# EAGLE design BCARDLIGHT (EAGLE 6.5.0)
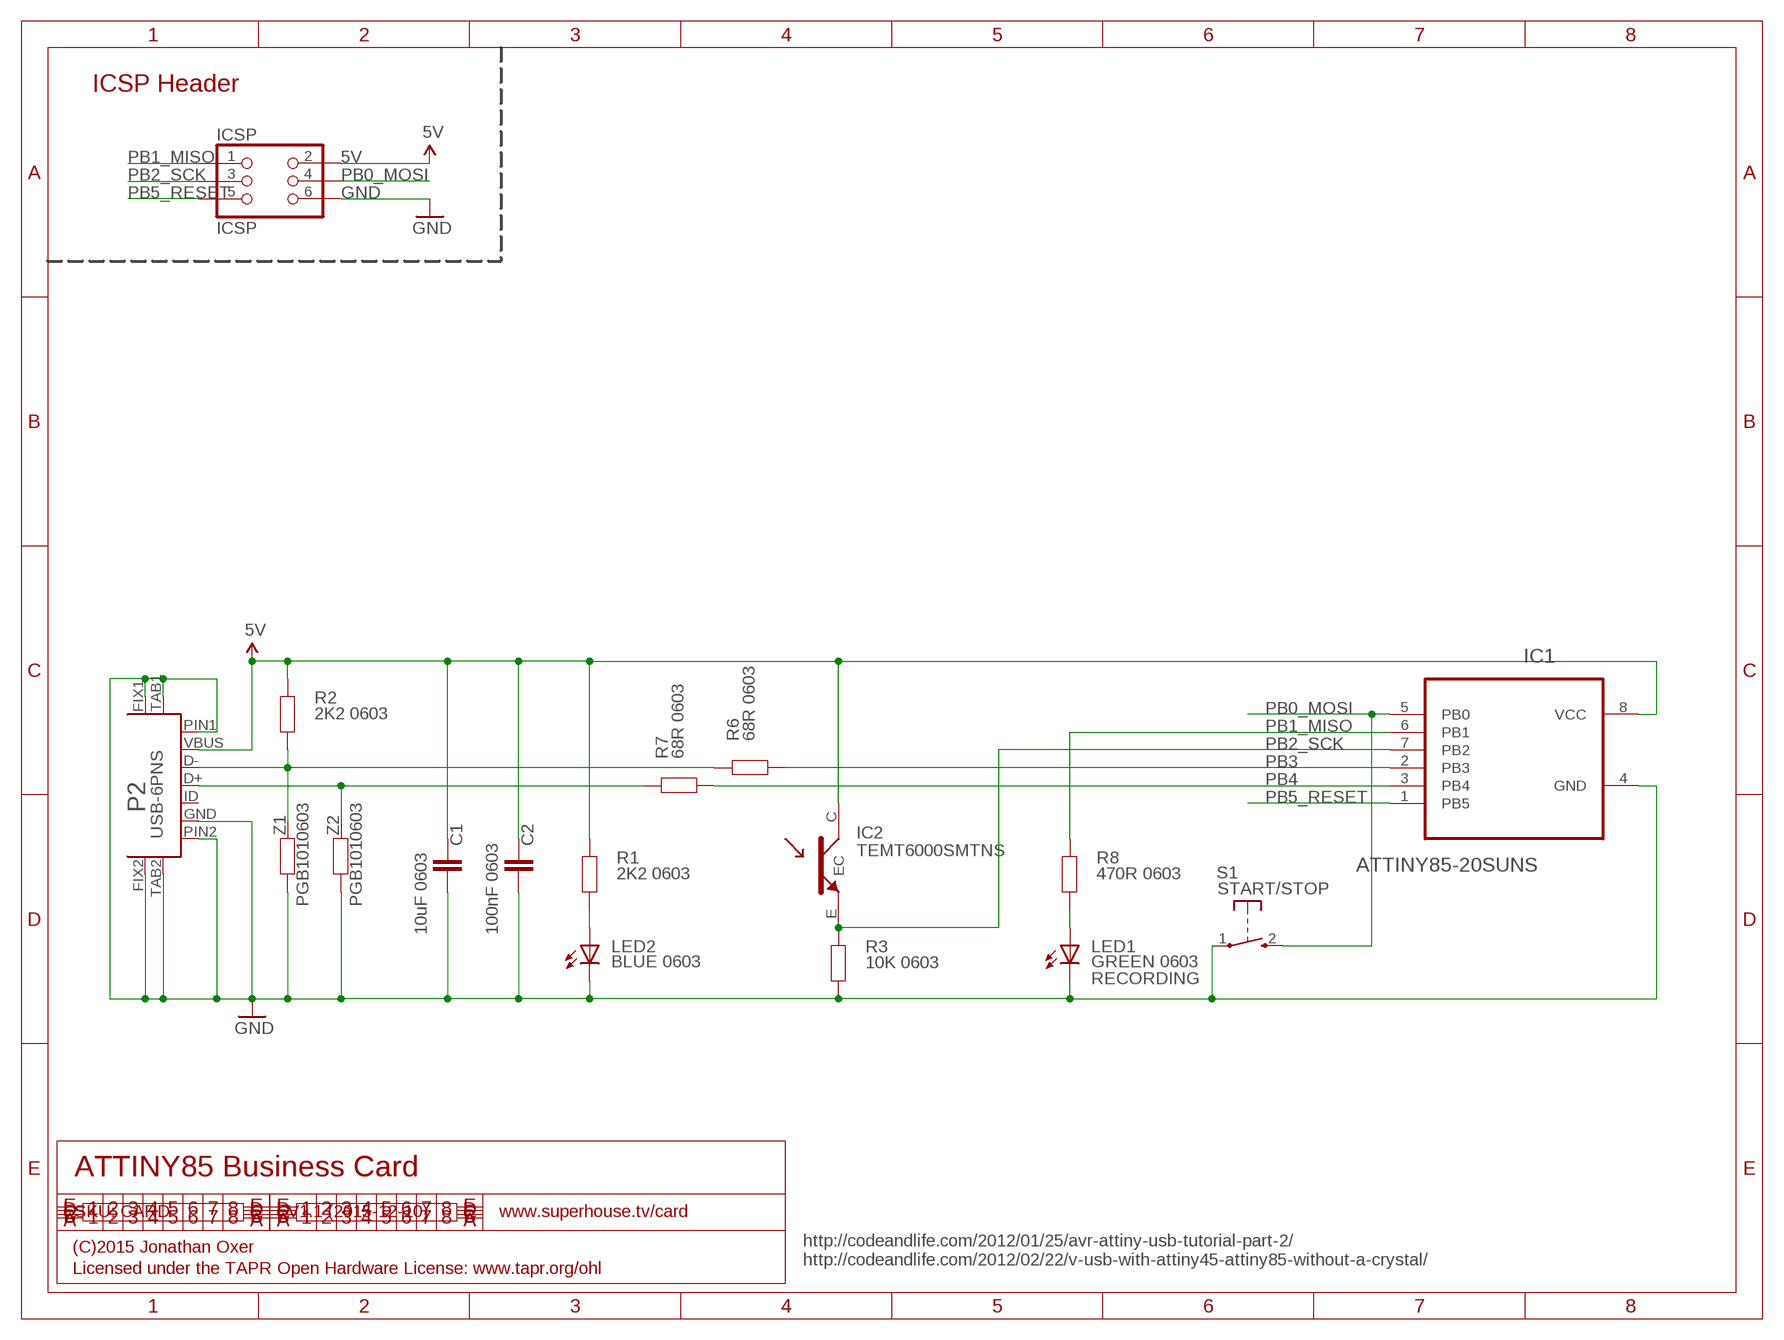
[diagram p0: schematic, sheet 1]

## Parts
C1  10uF 0603  CAPNS  [0603_NO_SILK]
C2  100nF 0603  CAPNS  [0603_NO_SILK]
IC1  ATTINY85-20SUNS  [SOIC127P798X216-8N_NO_SILK]
IC2  TEMT6000SMTNS  [TEMT6000_NO_SILK]
ICSP  ICSP  ICSPSMTNS  [2X03SURFACE_NO_SILK]
LED1  GREEN 0603  LED0603NS  [0603_NO_SILK]
LED2  BLUE 0603  LED0603NS  [0603_NO_SILK]
P2  USB-6PNS  [USB-MICROB-MB05PMXX_NO_SILK]
R1  2K2 0603  RESISTOR0603NS  [0603_NO_SILK]
R2  2K2 0603  RESISTOR0603NS  [0603_NO_SILK]
R3  10K 0603  RESISTOR0603NS  [0603_NO_SILK]
R6  68R 0603  RESISTOR0603NS  [0603_NO_SILK]
R7  68R 0603  RESISTOR0603NS  [0603_NO_SILK]
R8  470R 0603  RESISTOR0603NS  [0603_NO_SILK]
S1  START/STOP  TAC_SWITCH_2PINNS  [TACTILE_SWITCH_SMD_2PIN_TINY_NO_SILK]
Z1  PGB1010603  RESISTOR0603NS  [0603_NO_SILK]
Z2  PGB1010603  RESISTOR0603NS  [0603_NO_SILK]

## Nets
5V: C1.1 C2.1 IC1.8(VCC) IC2.C ICSP.2 P2.VBUS R1.2 R2.2
D+: P2.D+ R7.2 Z2.2
D-: P2.D- R2.1 R6.2 Z1.2
GND: C1.2 C2.2 IC1.4(GND) ICSP.6 LED1.2(C) LED2.2(C) P2.FIX1 P2.FIX2 P2.GND P2.PIN1 P2.PIN2 P2.TAB1 P2.TAB2 R3.1 S1.1(P) Z1.1 Z2.1
N$1: LED2.1(A) R1.1
N$11: LED1.1(A) R8.1
PB0_MOSI: IC1.5(PB0) ICSP.4 S1.2(S)
PB1_MISO: IC1.6(PB1) ICSP.1 R8.2
PB2_SCK: IC1.7(PB2) IC2.E ICSP.3 R3.2
PB3: IC1.2(PB3) R6.1
PB4: IC1.3(PB4) R7.1
PB5_RESET: IC1.1(PB5) ICSP.5
Unconnected: P2.ID

## Notes on the sheet
- ICSP Header
- RECORDING
- ATTINY85 Business Card
- SKU: CARD | V1.1 (2015-12-10) | www.superhouse.tv/card
- (C)2015 Jonathan Oxer
- http://codeandlife.com/2012/01/25/avr-attiny-usb-tutorial-part-2/
  http://codeandlife.com/2012/02/22/v-usb-with-attiny45-attiny85-without-a-crystal/
- Licensed under the TAPR Open Hardware License: www.tapr.org/ohl

## Library data of the parts
C1 C2 = freetronics-jon:CAP: Capacitor Standard 0603 ceramic capacitor, and 0.1" leaded capacitor.
IC1 = freetronics-jon:ATTINY85-20SU: 8-bit Microcontroller with In-System Programmable Flash
IC2 = freetronics-jon:TEMT6000
ICSP = freetronics-jon:ICSP
LED1 LED2 = freetronics-jon:LED: LEDs Standard schematic elements and footprints for 5mm, 3mm, 1206, and 0603 sized LEDs. 5mm - Spark Fun Electronics SKU : COM-00529 (and others)
P2 = freetronics-jon:USB-6P
R1-R3 R6-R8 Z1 Z2 = freetronics-jon:RESISTOR: Resistor Basic schematic elements and footprints for 0603, 1206, and PTH 1/10th watt (small) resistors.
S1 = freetronics-jon:TAC_SWITCH_2PIN: Momentary Tactile Switch - 2 pin

## Net classes
0 default: width 0.152 mm, drill 0.241 mm, clearance 0.152 mm

## Board
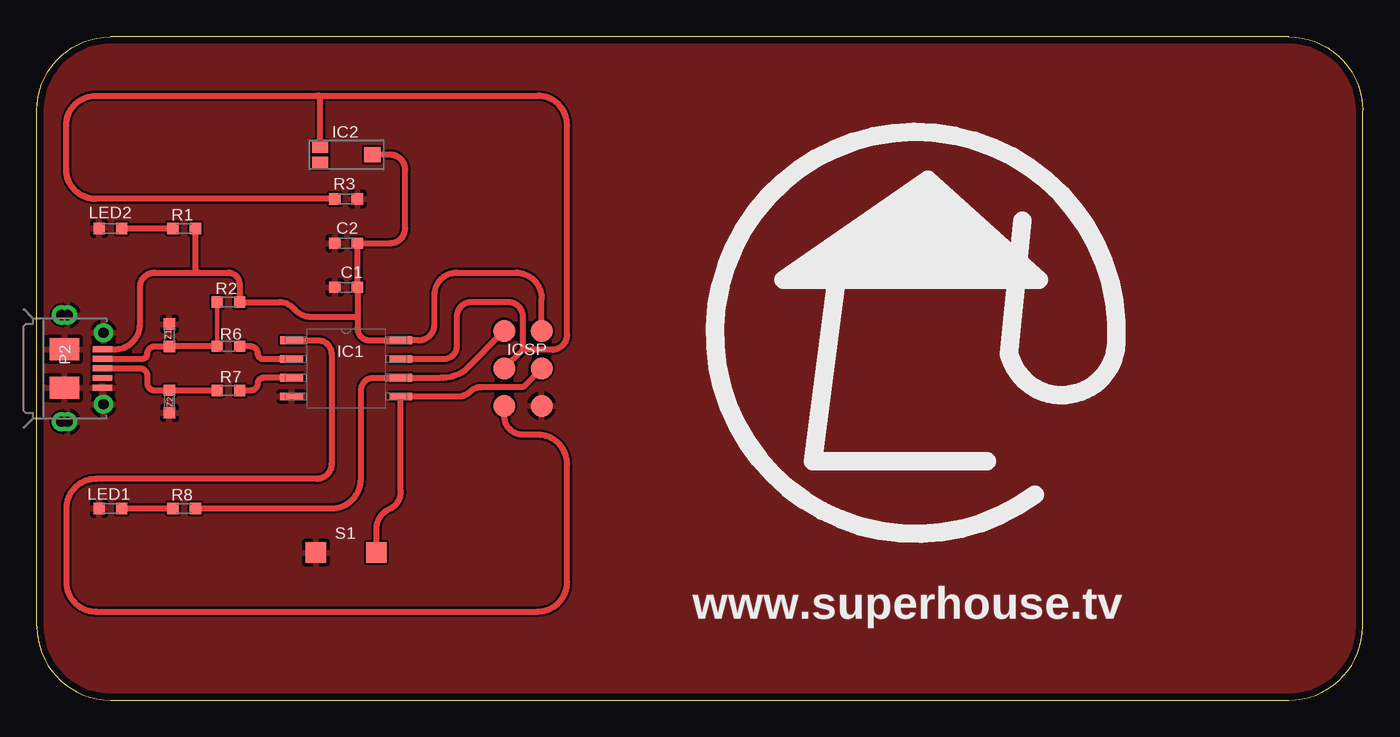
[diagram p1: board, top side]
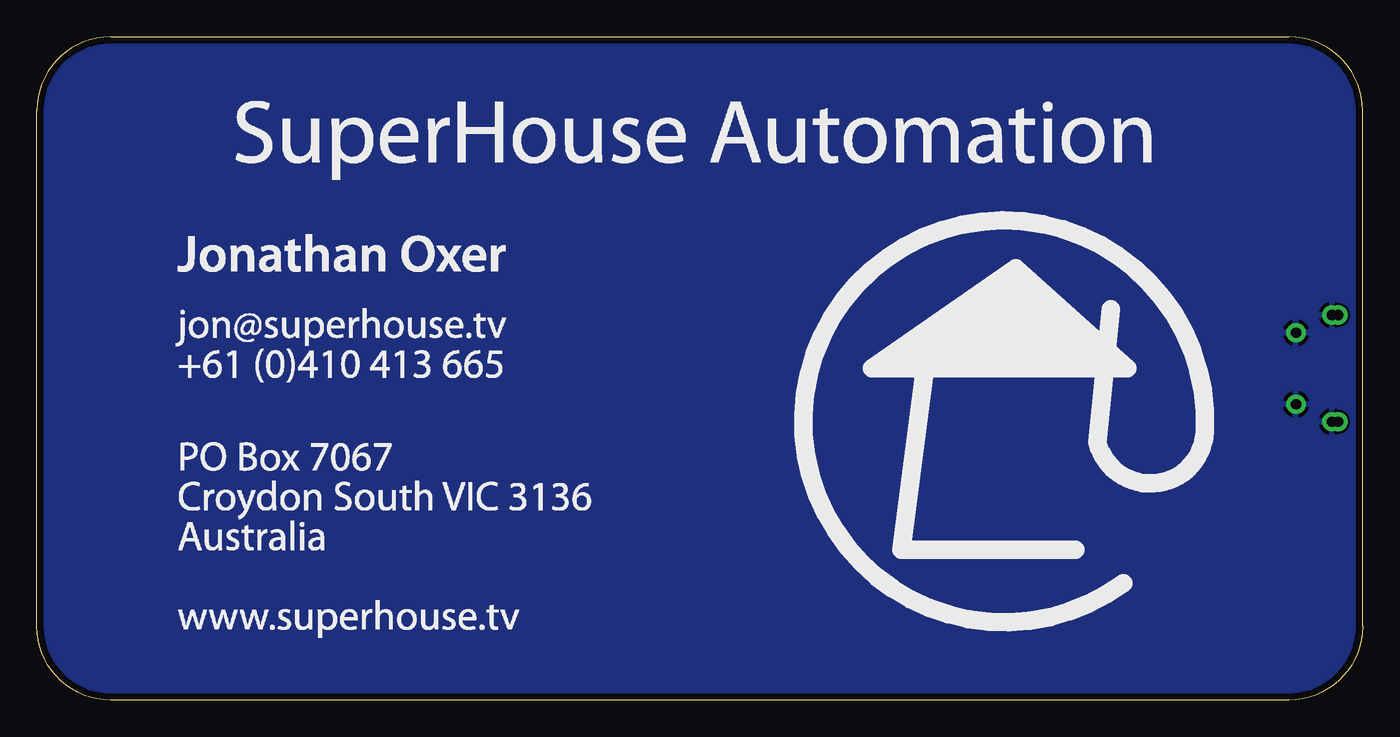
[diagram p2: board, bottom side, seen from below]

Size 90 x 45 mm. Coordinates in mm from the lower left corner, seen from the top.
Outline: 5,0 85,0 arc90 90,5 90,40 arc90 85,45 5,45 arc90 0,40 0,5 arc90 5,0
Copper layers (1*16): Top 0.035mm / dielectric 1.5mm / Bottom 0.035mm
Design rules "default *": minimum track width 6mil, minimum drill 9.5mil, track to track 6mil, track to pad 6mil, pad to pad 6mil, via to via 6mil, smd to smd 6mil, copper to edge 18mil, drill to drill 8mil, minimum pad ring 12mil, minimum via ring 4mil, stop-mask expansion 2mil, vias tented up to drill 25mil, thermal gap 10mil

### Footprints (pad centres in the part's own frame; a part is rotated, then mirrored left to right if it is on the bottom)
0603_NO_SILK = smd 0.762 x 0.762: 1 -0.762,0; 2 0.762,0
SOIC127P798X216-8N_NO_SILK = smd 1.549 x 0.533: 1 -3.708,1.905; 2 -3.708,0.635; 3 -3.708,-0.635; 4 -3.708,-1.905; 5 3.708,-1.905; 6 3.708,-0.635; 7 3.708,0.635; 8 3.708,1.905
TEMT6000_NO_SILK = smd 1.1 x 1: C 2.28,0 | smd 1.1 x 0.8: E -1.27,0.55; NC -1.27,-0.55
2X03SURFACE_NO_SILK = smd 1.5 x 1.5: 1 -2.54,-1.27; 2 -2.54,1.27; 3 0,-1.27; 4 0,1.27; 5 2.54,-1.27; 6 2.54,1.27
USB-MICROB-MB05PMXX_NO_SILK = smd 0.4 x 1.35: D+ 0,2.575; D- -0.65,2.575; GND 1.3,2.575; ID 0.65,2.575; VBUS -1.3,2.575 | smd 1.5 x 2: FIX1 -1.3,0; FIX2 1.3,0 | drill 0.7: PIN1 -2.425,2.65; PIN2 2.425,2.65; SLOT1 -3.625,-0.2; SLOT2 3.625,-0.2; TAB1 -3.625,0.2; TAB2 3.625,0.2
TACTILE_SWITCH_SMD_2PIN_TINY_NO_SILK = smd 1.4 x 1.4: 1 -2.05,0; 2 2.05,0

### Placement (x,y rotation side)
C1  21,28 180 top
C2  21,31 180 top
IC1  21,22.5 0 top
IC2  20.5,37 0 top
ICSP  33,22.5 270 top
LED1  5,13 180 top
LED2  5,32 180 top
P2  1.88,22.5 270 top
R1  10,32 0 top
R2  13,27 0 top
R3  21,34 180 top
R6  13,24 180 top
R7  13,21 180 top
R8  10,13 0 top
S1  21,10 0 top
Z1  9,24.75 270 top
Z2  9,20.25 90 top

### Tracks (layer width: path | path; a pad name or v marks a point on that pad's centre or on a via)
5V
  Top 0.406: P2.VBUS 5.3,23.8 arc90 7,25.5 7,28 arc-90 8,29 10.76,29 | IC2.C 24,37 arc-90 25,36 25,32 arc-90 24,31 C2.1 C1.1 21.76,26 | 21.76,26 21.76,25.24 arc90 22.59,24.41 IC1.8 25.91,24.41 arc90 27,25.5 27,27.5 arc-90 28.5,29 32.5,29 arc-90 34.27,27.23 ICSP.2 | 21.76,26 18.5,26 arc-45 17.5,26.5 arc45 16.5,27 R2.2 13.76,28.24 arc90 13,29 11,29 10.76,29 | R1.2 10.76,29
D+
  Top 0.305: 9.24,21 Z2.2
  Top 0.406: P2.D+ 7,22.5 arc-90 7.5,22 7.5,21.5 arc90 7.99,21.01 Z2.2 | R7.2 9.24,21
D-
  Top 0.305: 9.24,24 Z1.2 | R6.2 R2.1
  Top 0.406: P2.D- 7.15,23.15 arc90 7.5,23.5 arc-90 7.99,23.99 Z1.2 | R6.2 9.24,24
GND
  pour Bottom: 0,40 arc-90 5,45 85,45 arc-90 90,40 90,5 arc-90 85,0 5,0 arc-90 0,5
  pour Top: 0,40 arc-90 5,45 85,45 arc-90 90,40 90,5 arc-90 85,0 5,0 arc-90 0,5
N$1
  Top 0.406: LED2.1 R1.1
N$11
  Top 0.406: LED1.1 R8.1
PB0_MOSI
  Top 0.406: ICSP.4 33,21.23 30.23,21.23 arc50 29.5,21 arc-45 28.59,20.59 IC1.5 24.71,14.21 arc-70 24,13 arc70 23.05,11.55 S1.2
PB1_MISO
  Top 0.406: R8.2 20,13 arc90 22,15 22,21 arc-90 22.86,21.86 IC1.6 27.36,21.86 arc40 29.05,22.36 ICSP.1
PB2_SCK
  Top 0.406: 33,23.77 33,26 arc90 32,27 29.5,27 arc90 28.5,26 28.5,24 arc-90 27.64,23.14 IC1.7 | ICSP.3 33,23.77 | 33,23.77 34.97,23.77 arc90 36,24.8 36,39 arc90 34,41 19.23,41 | R3.2 4,34 arc-90 2,36 2,39 arc-90 4,41 19,41 19.23,41 | IC2.E 19.23,41
PB3
  Top 0.406: IC1.2 15.37,23.14 arc-90 15,23.5 arc90 14.5,24 R6.1
PB4
  Top 0.406: IC1.3 15.37,21.86 arc90 15,21.5 arc-90 14.5,21 R7.1
PB5_RESET
  Top 0.406: IC1.1 19.09,24.41 arc-90 20,23.5 20,16 arc-90 19,15 4,15 arc90 2,13 2,8 arc90 4,6 34,6 arc90 36,8 36,16 arc90 34,18 33,18 arc-90 31.73,19.27 ICSP.5

### Text on the board
tPlace: www.superhouse.tv
tNames: S1